# Altium schematic sheet BEESP_CODE_main.SchDoc
size A4
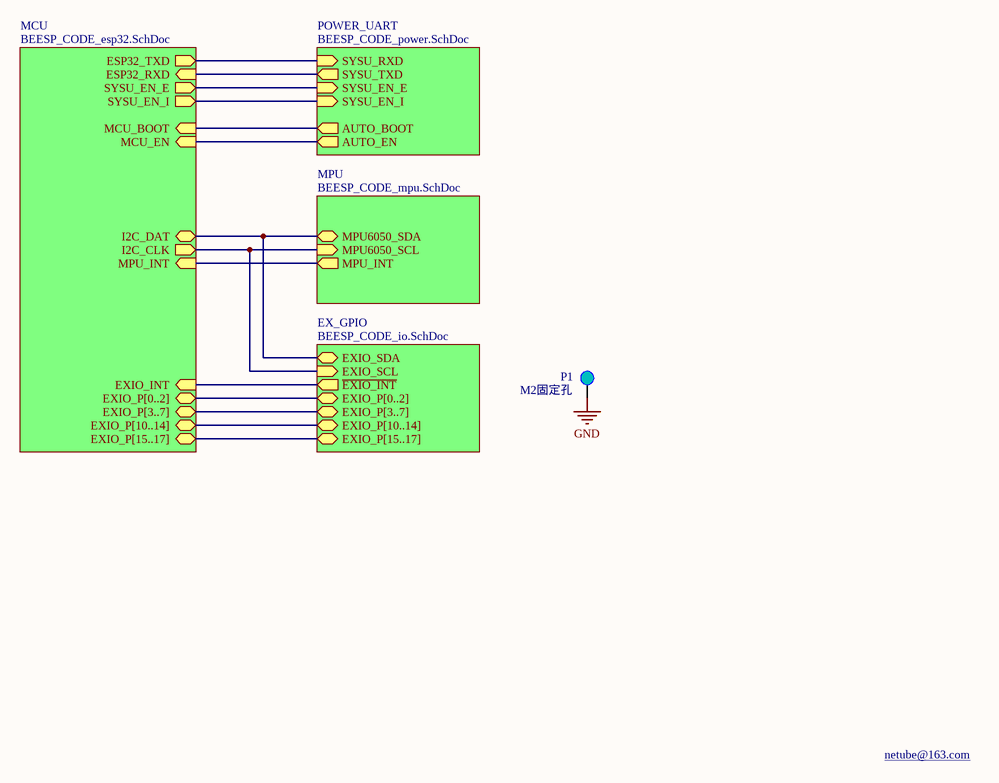
[diagram p0: BEESP_CODE_main.SchDoc]

## Parts
P1  M2固定孔  [M2]

## Sub-sheets
EX_GPIO = BEESP_CODE_io.SchDoc: EXIO_SDA (bidir), ~{EXIO_INT} (out), EXIO_SCL (in), EXIO_P[15..17] (bidir), EXIO_P[10..14] (bidir), EXIO_P[0..2] (bidir), EXIO_P[3..7] (bidir)
MCU = BEESP_CODE_esp32.SchDoc: I2C_CLK (out), MCU_EN (in), MCU_BOOT (in), I2C_DAT (bidir), EXIO_INT (in), MPU_INT (in), EXIO_P[10..14] (bidir), EXIO_P[15..17] (bidir), EXIO_P[3..7] (bidir), EXIO_P[0..2] (bidir), SYSU_EN_E (out), SYSU_EN_I (out), ESP32_RXD (in), ESP32_TXD (out)
MPU = BEESP_CODE_mpu.SchDoc: MPU6050_SDA (bidir), MPU6050_SCL (in), MPU_INT (out)
POWER_UART = BEESP_CODE_power.SchDoc: SYSU_RXD (in), SYSU_EN_E (in), SYSU_TXD (out), SYSU_EN_I (in), AUTO_EN (out), AUTO_BOOT (out)

## Nets
GND: P1.1
(unnamed): sheet MCU/I2C_CLK, sheet MPU/MPU6050_SCL, sheet EX_GPIO/EXIO_SCL
(unnamed): sheet MCU/MCU_EN, sheet POWER_UART/AUTO_EN
(unnamed): sheet MCU/MCU_BOOT, sheet POWER_UART/AUTO_BOOT
(unnamed): sheet MCU/I2C_DAT, sheet MPU/MPU6050_SDA, sheet EX_GPIO/EXIO_SDA
(unnamed): sheet MCU/EXIO_INT, sheet EX_GPIO/~{EXIO_INT}
(unnamed): sheet MCU/MPU_INT, sheet MPU/MPU_INT
(unnamed): sheet MCU/SYSU_EN_E, sheet POWER_UART/SYSU_EN_E
(unnamed): sheet MCU/SYSU_EN_I, sheet POWER_UART/SYSU_EN_I
(unnamed): sheet MCU/ESP32_RXD, sheet POWER_UART/SYSU_TXD
(unnamed): sheet MCU/ESP32_TXD, sheet POWER_UART/SYSU_RXD

## Buses and harness runs
bus sheet EX_GPIO/EXIO_P[0..2] = sheet MCU/EXIO_P[0..2]
bus sheet EX_GPIO/EXIO_P[3..7] = sheet MCU/EXIO_P[3..7]
bus sheet EX_GPIO/EXIO_P[10..14] = sheet MCU/EXIO_P[10..14]
bus sheet EX_GPIO/EXIO_P[15..17] = sheet MCU/EXIO_P[15..17]

## Notes on the sheet
- netube@163.com

## Library data of the parts
P1 = M3